# EAGLE design MAAV roomba (EAGLE 6.4)
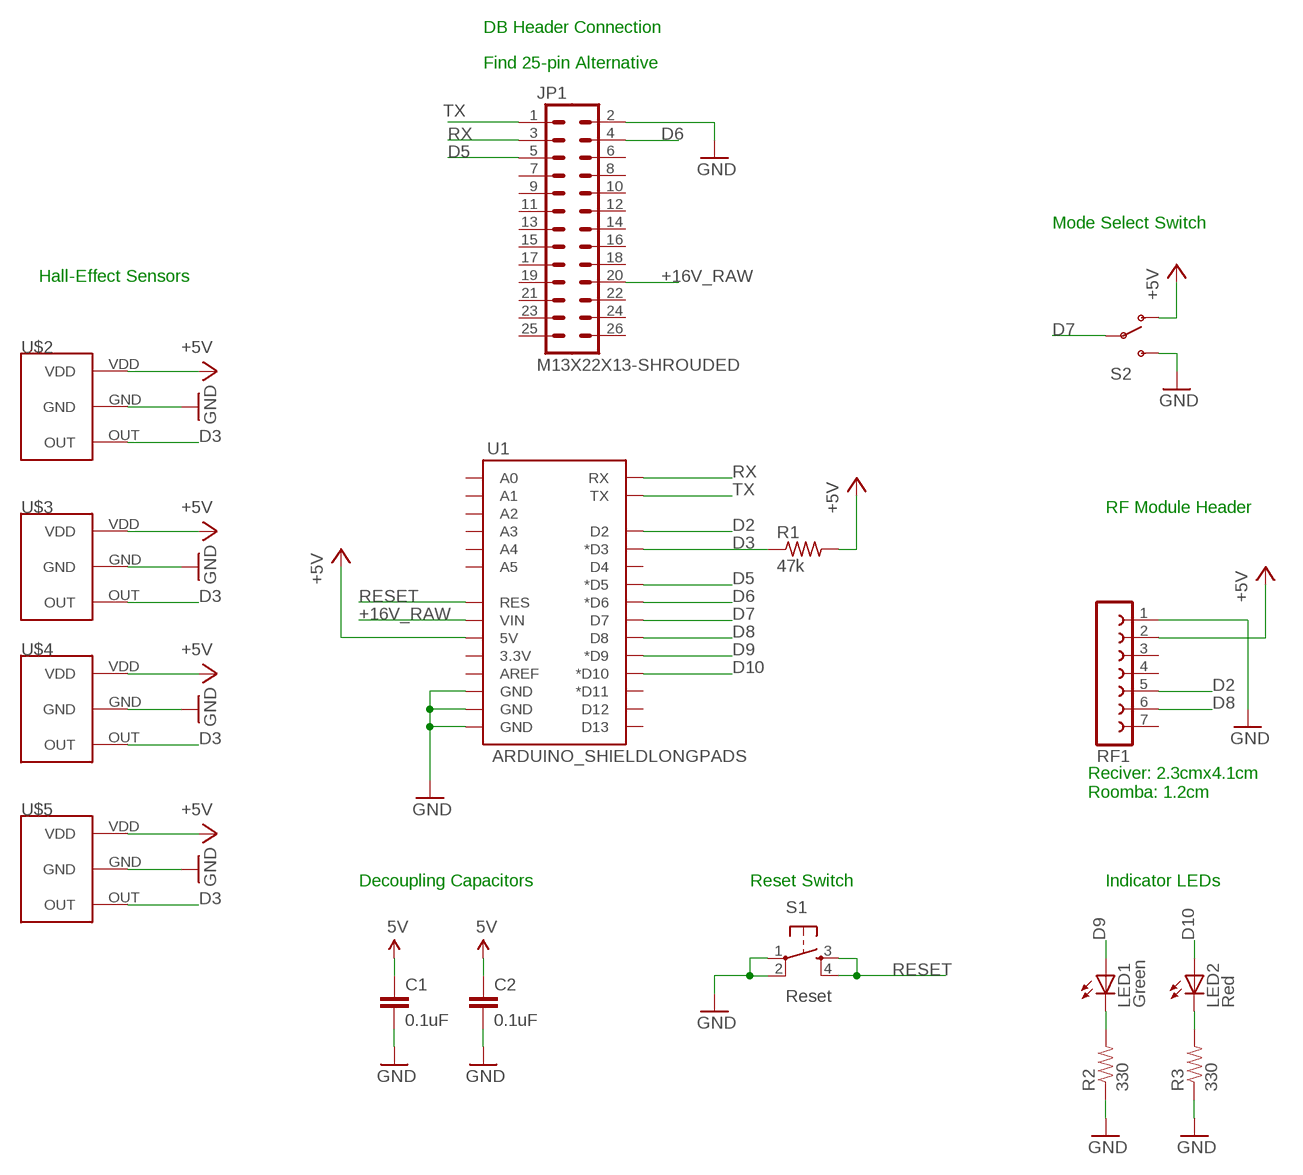
[diagram p0: schematic, sheet 1]

## Parts
C1  0.1uF  CAPPTH2  [CAP-PTH-SMALL2]
C2  0.1uF  CAPPTH2  [CAP-PTH-SMALL2]
JP1  M13X22X13-SHROUDED  [2X25-SHROUDED]
LED1  Green  LED5MM  [LED5MM]
LED2  Red  LED5MM  [LED5MM]
R1  47k  R-US_0309/10  [0309/10]
R2  330  RESISTORPTH-1/4W  [AXIAL-0.4]
R3  330  RESISTORPTH-1/4W  [AXIAL-0.4]
RF1  FE07W  [FE07W]
S1  Reset  TAC_SWITCHPTH  [TACTILE-PTH]
S2  SWITCH-SPDTPTH  [SWITCH-SPDT]
U1  ARDUINO_SHIELDLONGPADS  [DUEMILANOVE_SHIELD_LONGPADS]
U$2  HALL_EFFECT  [HALL_EFFECT]
U$3  HALL_EFFECT  [HALL_EFFECT]
U$4  HALL_EFFECT  [HALL_EFFECT]
U$5  HALL_EFFECT  [HALL_EFFECT]

## Nets
5V [power]: C1.1 C2.1 R1.2 RF1.2 S2.1(O) U1.5V U$2.VDD U$3.VDD U$4.VDD U$5.VDD ; supply symbol labelled +5V
+16V_RAW: JP1.20 U1.VIN
D2: RF1.5 U1.D2
D3: R1.1 U1.D3(*D3) U$2.OUT U$3.OUT U$4.OUT U$5.OUT
D5: JP1.5 U1.D5(*D5)
D6: JP1.4 U1.D6(*D6)
D7: S2.2(P) U1.D7
D8: RF1.6 U1.D8
D9: LED1.A U1.D9(*D9)
D10: LED2.A U1.D10(*D10)
GND: C1.2 C2.2 JP1.2 R2.P$1 R3.P$1 RF1.1 S1.1 S1.2 S2.3(S) U1.GND@0(GND) U1.GND@1(GND) U1.GND@2(GND) U$2.GND U$3.GND U$4.GND U$5.GND
N$15: LED1.K(C) R2.P$2
N$16: LED2.K(C) R3.P$2
RESET: S1.3 S1.4 U1.RES
RX: JP1.3 U1.RX
TX: JP1.1 U1.TX
Unconnected: JP1.6 JP1.7 JP1.8 JP1.9 JP1.10 JP1.11 JP1.12 JP1.13 JP1.14 JP1.15 JP1.16 JP1.17 JP1.18 JP1.19 JP1.21 JP1.22 JP1.23 JP1.24 JP1.25 JP1.26 RF1.3 RF1.4 RF1.7 U1.3.3V U1.A0 U1.A1 U1.A2 U1.A3 U1.A4 U1.A5 U1.AREF U1.D4 U1.D11(*D11) U1.D12 U1.D13

## Notes on the sheet
- DB Header Connection
- Find 25-pin Alternative
- Mode Select Switch
- Hall-Effect Sensors
- RF Module Header
- Reciver: 2.3cmx4.1cm
  Roomba: 1.2cm
- Decoupling Capacitors | Reset Switch | Indicator LEDs

## Library data of the parts
C1 C2 = SparkFun:CAP: Capacitor Standard 0603 ceramic capacitor, and 0.1" leaded capacitor.; DIGIKEY: 399-4264-ND
JP1 = SparkFun-Connectors:M13X2: 0.1" spaced headers
LED1 = SparkFun:LED: LEDs Standard schematic elements and footprints for 5mm, 3mm, 1206, and 0603 sized LEDs. 5mm - Spark Fun Electronics SKU : COM-00529 (and others); DIGIKEY: 1125-1184-ND
LED2 = SparkFun:LED: LEDs Standard schematic elements and footprints for 5mm, 3mm, 1206, and 0603 sized LEDs. 5mm - Spark Fun Electronics SKU : COM-00529 (and others); DIGIKEY: 1125-1188-ND
R1 = resistor:R-US_: RESISTOR, American symbol; DIGIKEY: CF12JT47K0
R2 R3 = SparkFun-Resistors:RESISTOR: Resistor Basic schematic elements and footprints for 0603, 1206, and PTH resistors.; DIGIKEY: 330QBK-ND
RF1 = con-lsta:FE07W: FEMALE HEADER; DIGIKEY: S5443-ND; OC_FARNELL: unknown; OC_NEWARK: unknown
S1 = SparkFun:TAC_SWITCH: Momentary Switch Button commonly used for reset or general input. Spark Fun Electronics SKU : COM-00097; DIGIKEY: 450-1650-ND
S2 = SparkFun-Electromechanical:SWITCH-SPDT: SPDT Switch Simple slide switch, Spark Fun Electronics SKU : COM-00102 DPDT SMT slide switch, AYZ0202, SWCH-08179; DIGIKEY: EG1903-ND
U1 = SparkFun-Boards:ARDUINO_SHIELD: Arduino shield footprint
U$2-U$5 = iarc_ground_robot:HALL_EFFECT; MOUSER: 621-AH180-PL-A

## Net classes
1 power: width 0.254 mm

## Board
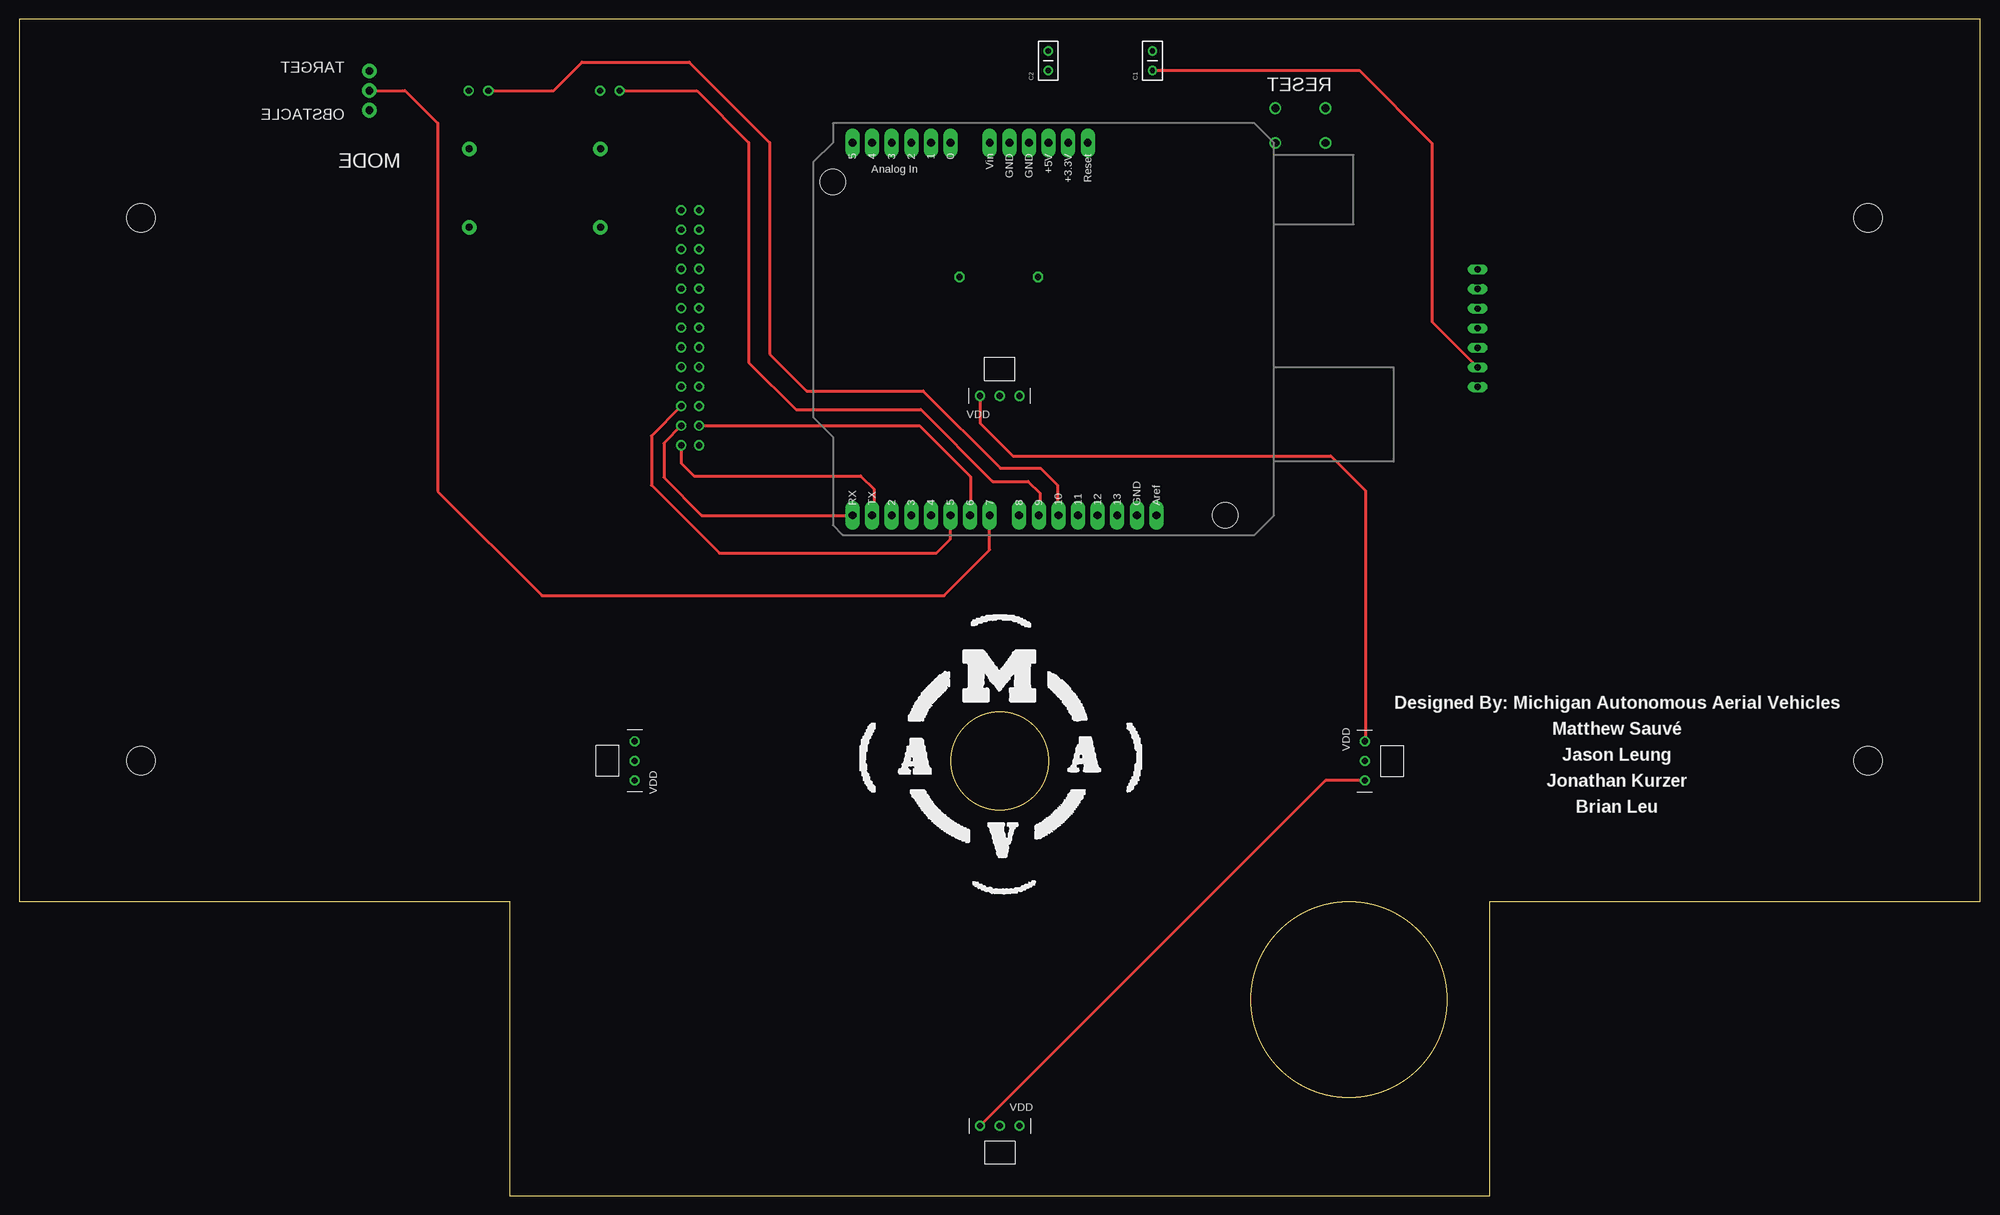
[diagram p1: board, top side]
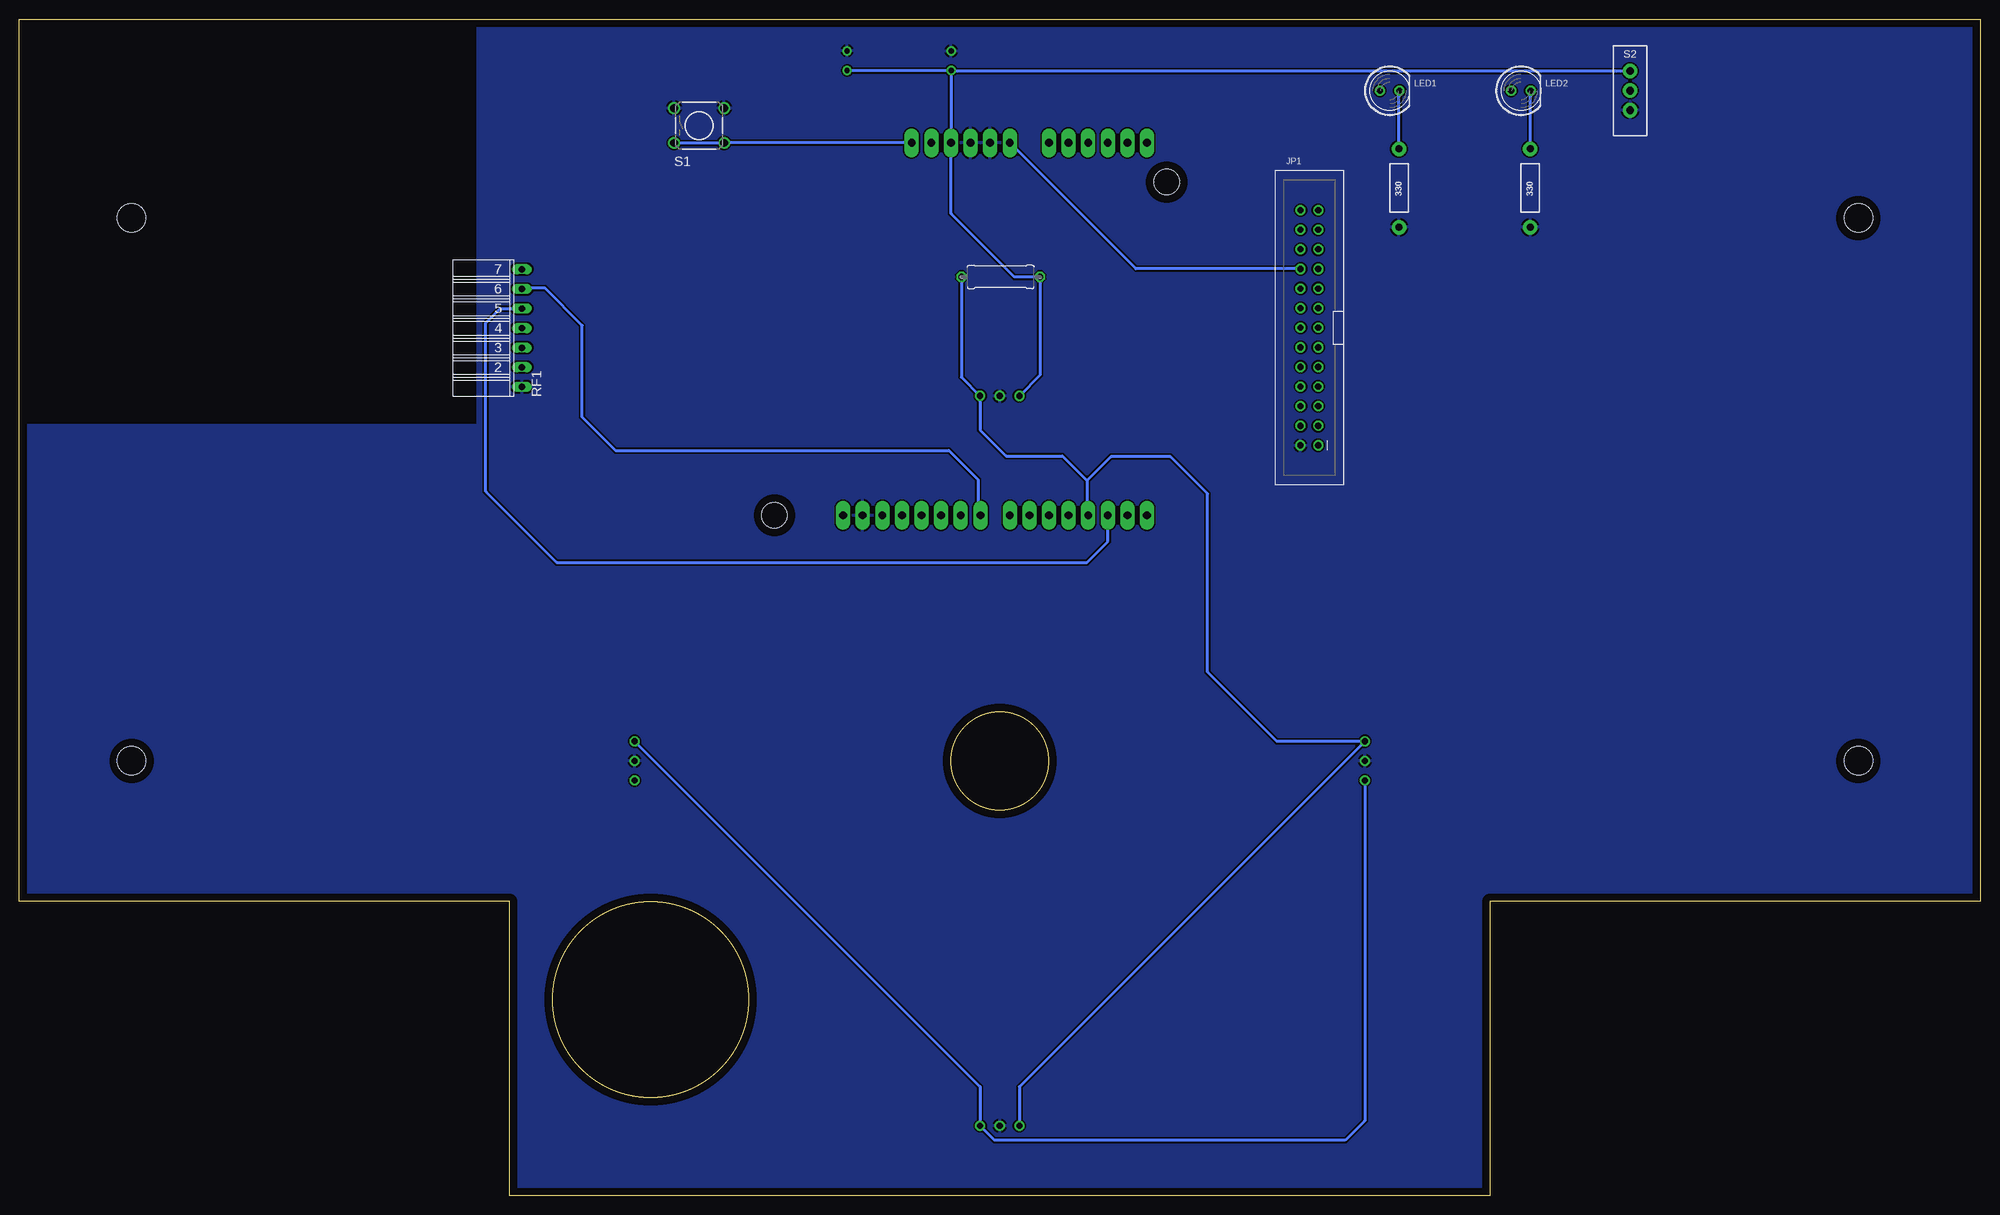
[diagram p2: board, bottom side, seen from below]

Size 254 x 152.4 mm. Coordinates in mm from the lower left corner, seen from the top.
Copper layers (1*16): Top 0.035mm / dielectric 1.5mm / Bottom 0.035mm
Design rules "default": minimum track width 10mil, minimum drill 24mil, track to track 8mil, track to pad 8mil, pad to pad 8mil, via to via 8mil, smd to smd 8mil, copper to edge 40mil, drill to drill 8mil, minimum pad ring 10mil, minimum via ring 8mil, stop-mask expansion 4mil, vias tented up to drill 0mil, thermal gap 10mil

### Footprints (pad centres in the part's own frame; a part is rotated, then mirrored left to right if it is on the bottom)
CAP-PTH-SMALL2 = drill 0.7: 1 0,0; 2 2.54,0
2X25-SHROUDED = drill 0.8: 1 -1.143,15.24; 2 1.143,15.24; 3 -1.143,12.7; 4 1.143,12.7; 5 -1.143,10.16; 6 1.143,10.16; 7 -1.143,7.62; 8 1.143,7.62; 9 -1.143,5.08; 10 1.143,5.08; 11 -1.143,2.54; 12 1.143,2.54; 13 -1.143,0; 14 1.143,0; 15 -1.143,-2.54; 16 1.143,-2.54; 17 -1.143,-5.08; 18 1.143,-5.08; 19 -1.143,-7.62; 20 1.143,-7.62; 21 -1.143,-10.16; 22 1.143,-10.16; 23 -1.143,-12.7; 24 1.143,-12.7; 25 -1.143,-15.24; 26 1.143,-15.24
LED5MM = drill 0.813: A -1.27,0; K 1.27,0
0309/10 = drill 0.813 octagon: 1 -5.08,0; 2 5.08,0
AXIAL-0.4 = drill 0.9 pad 1.88: P$1 -5.08,0; P$2 5.08,0
FE07W = drill 0.813 long: 1 -7.62,0; 2 -5.08,0; 3 -2.54,0; 4 0,0; 5 2.54,0; 6 5.08,0; 7 7.62,0
TACTILE-PTH = drill 1.016: 1 -3.251,2.261; 2 3.251,2.261; 3 -3.251,-2.261; 4 3.251,-2.261
SWITCH-SPDT = drill 1.016 pad 1.88: 1 0,2.54; 2 0,0; 3 0,-2.54
DUEMILANOVE_SHIELD_LONGPADS = drill 1.016 pad 1.88 long: 3.3V 50.8,26.67; 5V 50.8,29.21; A0 50.8,41.91; A1 50.8,44.45; A2 50.8,46.99; A3 50.8,49.53; A4 50.8,52.07; A5 50.8,54.61; AREF 2.54,15.24; D2 2.54,49.53; D3 2.54,46.99; D4 2.54,44.45; D5 2.54,41.91; D6 2.54,39.37; D7 2.54,36.83; D8 2.54,33.02; D9 2.54,30.48; D10 2.54,27.94; D11 2.54,25.4; D12 2.54,22.86; D13 2.54,20.32; GND@0 50.8,31.75; GND@1 50.8,34.29; GND@2 2.54,17.78; RES 50.8,24.13; RX 2.54,54.61; TX 2.54,52.07; VIN 50.8,36.83 | hole 3.302: 45.72,57.15; 2.54,6.35
IARC_GROUND_OUTLINE = hole 3.706: -111.216,0; -111.216,70.322; 112.446,70.322; 112.446,0
HALL_EFFECT = drill 0.8: GND 0,0; OUT 0,-2.54; VDD 0,2.54

### Placement (x,y rotation side)
C1  146.78,145.78 90 top
C2  133.28,145.75 90 top
JP1  86.89,112.44 180 bottom
LED1  76.49,143.14 0 bottom
LED2  59.49,143.14 0 bottom
R1  126.88,119.02 0 bottom
R2  75.29,130.54 90 bottom
R3  58.29,130.54 90 bottom
RF1  188.9,112.39 90 bottom
S1  165.94,138.64 0 bottom
S2  45.35,143.16 0 bottom
U1  162.53,85.6 90 top
U$1  [IARC_GROUND_OUTLINE]  127,56.32 0 top
U$2  79.71,56.32 180 top
U$3  174.29,56.32 0 top
U$4  127,9.03 270 top
U$5  127,103.61 90 top
U$6  [MAAV_CIRCLE]  126.97,56.74 0 top

### Tracks (layer width: path | path; a pad name or v marks a point on that pad's centre or on a via)
5V
  Top 0.406: C1.1 173.56,145.78 182.99,136.34 182.99,113.22 RF1.2 | U$5.VDD 124.46,100.07 128.69,95.84 169.89,95.84 174.39,91.34 174.39,58.96 U$3.VDD
  Bottom 0.406: U$3.VDD 129.54,14.11 U$4.VDD 127.69,7.19 82.25,7.19 79.71,9.73 U$2.VDD | S2.1 133.28,145.7 C2.1 | C2.1 133.32,145.75 U1.5V 133.29,136.36 133.29,127.24 125.07,119.02 R1.2 121.8,106.28 U$5.VDD | C2.1 146.78,145.75 C1.1
+16V_RAW
  Bottom 0.406: JP1.20 109.37,120.06 U1.VIN
D2
  Bottom 0.406: U1.D2 112.99,84.74 115.69,82.04 184.39,82.04 193.59,91.24 193.59,113.04 191.69,114.94 188.91,114.94 RF1.5
D3
  Top 0.406: U$3.OUT 169.21,53.78 U$4.OUT
  Bottom 0.406: U$4.OUT 124.46,14.11 U$2.OUT 91.11,58.86 100.09,67.84 100.09,90.94 104.89,95.74 112.59,95.74 115.69,92.64 | R1.1 131.96,106.03 U$5.OUT 129.54,99.19 126.19,95.84 118.89,95.84 115.69,92.64 | 115.69,92.64 115.69,88.28 U1.D3
D5
  Top 0.406: JP1.5 81.89,98.43 81.89,92.04 90.69,83.24 118.79,83.24 120.59,85.04 120.59,88.1 U1.D5
D6
  Top 0.406: JP1.4 116.59,99.74 123.19,93.14 123.19,88.16 U1.D6
D7
  Top 0.406: S2.2 49.97,143.16 54.19,138.94 54.19,91.24 67.69,77.74 119.79,77.74 125.69,83.64 U1.D7
D8
  Bottom 0.406: U1.D8 129.79,88.41 129.79,92.74 133.59,96.54 176.79,96.54 181.09,100.84 181.09,112.74 185.89,117.54 188.82,117.54 RF1.6
D9
  Top 0.406: LED1.A 87.79,143.14 94.49,136.44 94.49,107.94 100.59,101.84 116.79,101.84 126.09,92.54 130.69,92.54 132.19,91.04 132.19,88.27 U1.D9
D10
  Top 0.406: LED2.A 69.19,143.14 72.89,146.84 86.79,146.84 97.19,136.44 97.19,109.04 101.99,104.24 117.09,104.24 127.09,94.24 132.29,94.24 134.49,92.04 134.49,88.24 U1.D10
GND
  pour Bottom: -1.27,152.84 194.6,152.84 194.6,99.74 254,99.74 254,37.27 191.77,37.27 191.77,-0.83 62.23,-0.83 62.23,37.27 -1.27,37.27
N$15
  Bottom 0.406: R2.P$2 75.29,143.07 LED1.K
N$16
  Bottom 0.406: R3.P$2 58.29,143.07 LED2.K
RESET
  Bottom 0.406: U1.RES 162.69,136.4 S1.4 S1.3
RX
  Top 0.406: JP1.3 83.49,97.49 83.49,93.04 88.4,88.14 U1.RX
TX
  Top 0.406: JP1.1 85.75,94.89 87.39,93.24 108.99,93.24 110.69,91.54 110.69,88.36 U1.TX

### Text on the board
_tsilk: TARGET | RESET | OBSTACLE | MODE | Designed By: Michigan Autonomous Aerial Vehicles / Matthew Sauvé / Jason Leung / Jonathan Kurzer / Brian Leu